# EAGLE schematic ARM_board (EAGLE 6.1)
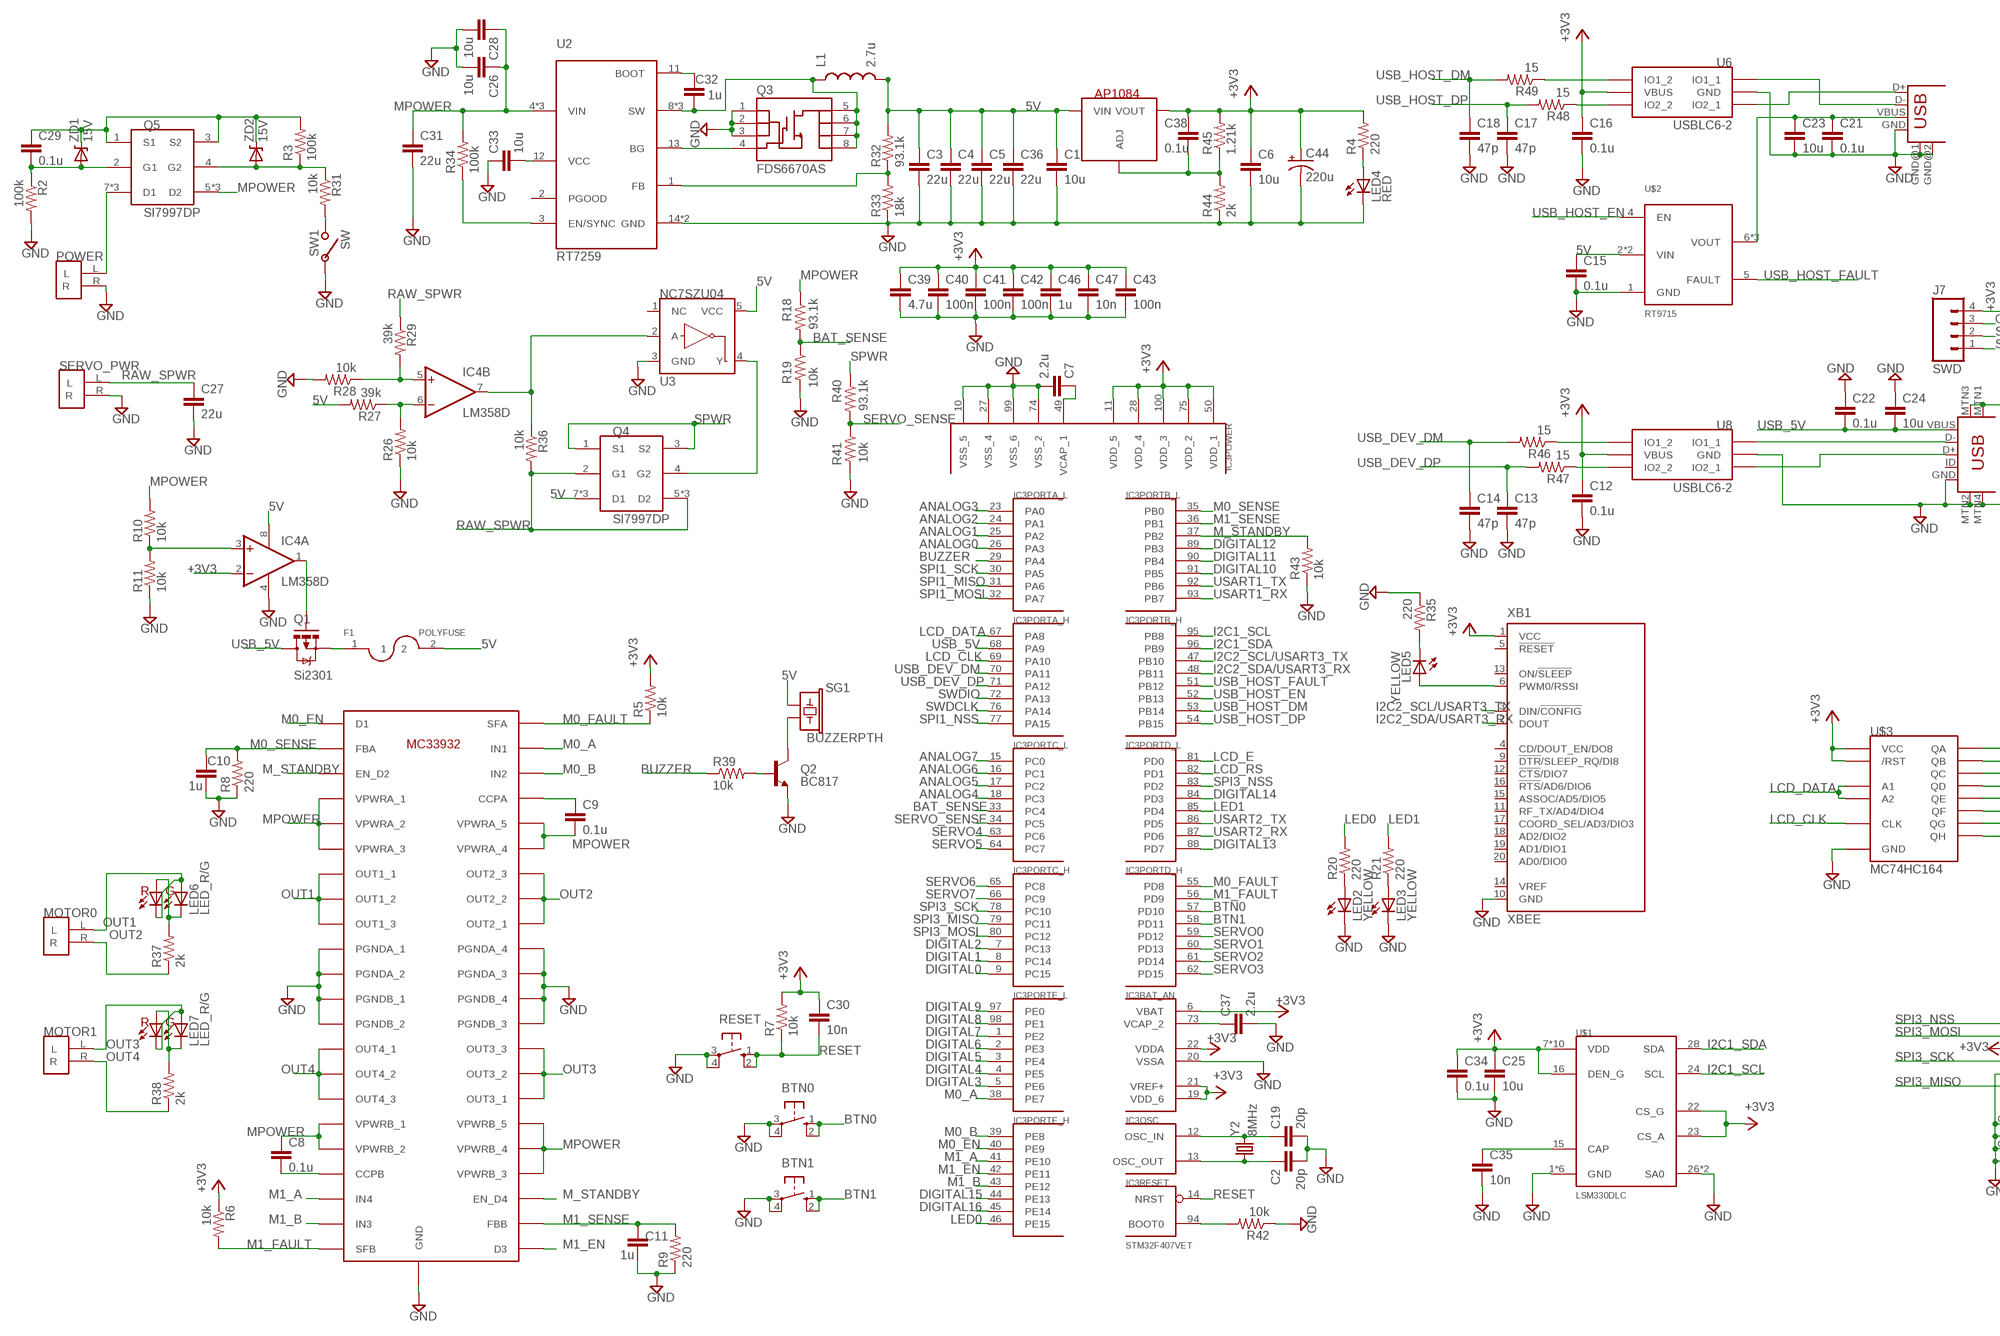
[diagram p0: schematic, sheet 1, part 1 of 2]
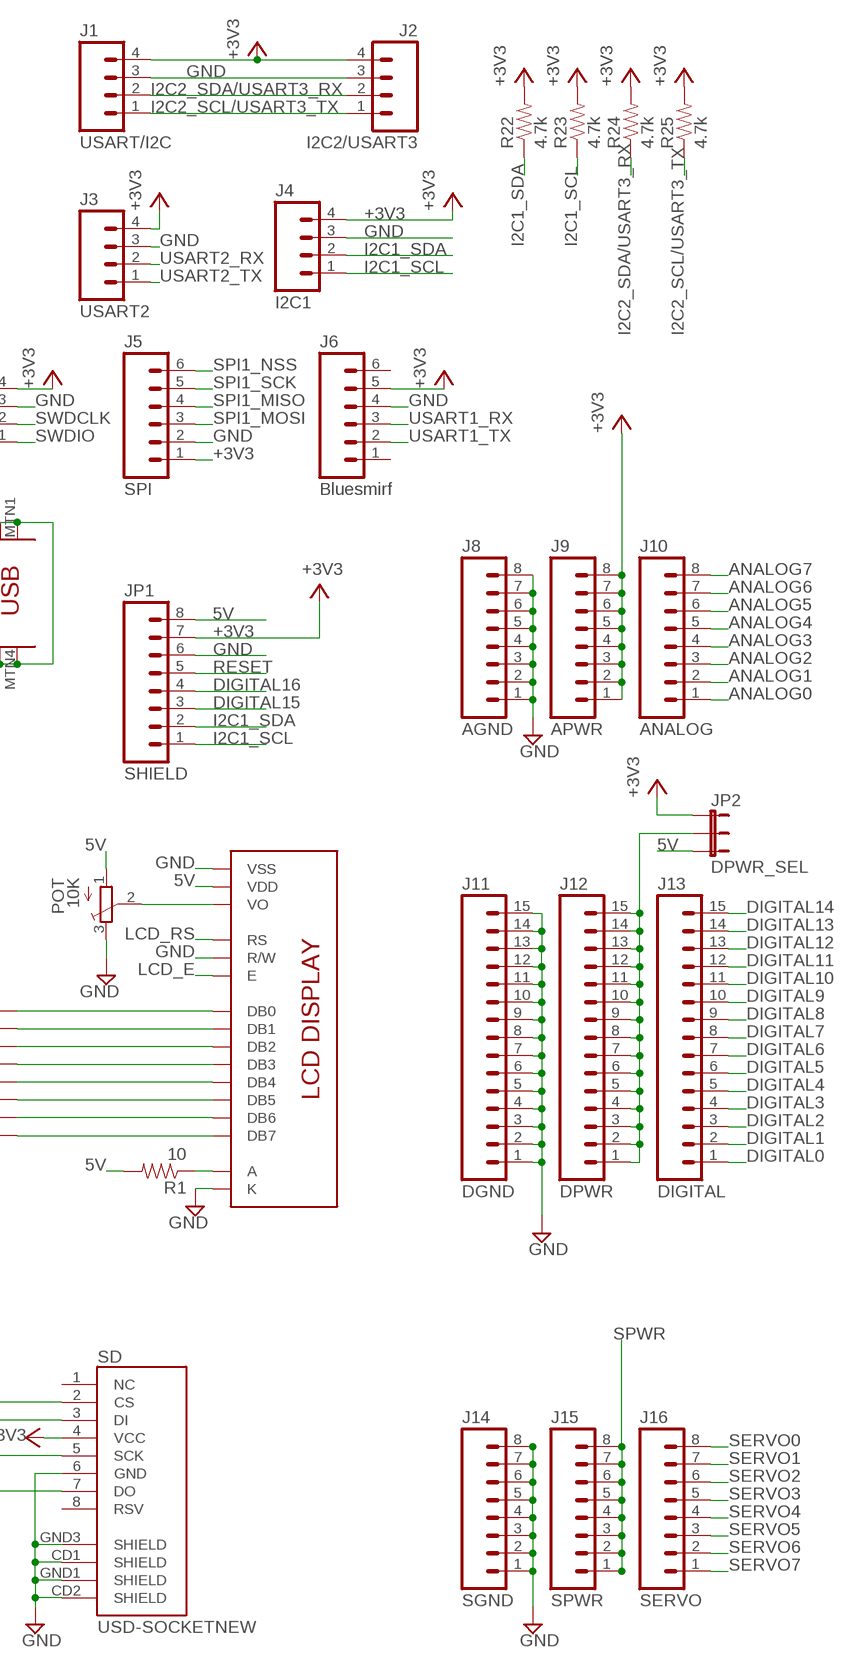
[diagram p1: schematic, sheet 1, part 2 of 2]

## Parts
AP1084  AP1084  [DPAK]
BTN0  10-XX  [B3F-10XX]
BTN1  10-XX  [B3F-10XX]
C1  10u  CAP0805  [0805]
C2  20p  CAP0603-CAP  [0603-CAP]
C3  22u  CAP0805  [0805]
C4  22u  CAP0805  [0805]
C5  22u  CAP0805  [0805]
C6  10u  CAP0805  [0805]
C7  2.2u  CAP0603-CAP  [0603-CAP]
C8  0.1u  CAP0603-CAP  [0603-CAP]
C9  0.1u  CAP0603-CAP  [0603-CAP]
C10  1u  CAP0603-CAP  [0603-CAP]
C11  1u  CAP0603-CAP  [0603-CAP]
C12  0.1u  CAP0603-CAP  [0603-CAP]
C13  47p  CAP0603-CAP  [0603-CAP]
C14  47p  CAP0603-CAP  [0603-CAP]
C15  0.1u  CAP0603-CAP  [0603-CAP]
C16  0.1u  CAP0603-CAP  [0603-CAP]
C17  47p  CAP0603-CAP  [0603-CAP]
C18  47p  CAP0603-CAP  [0603-CAP]
C19  20p  CAP0603-CAP  [0603-CAP]
C21  0.1u  CAP0603-CAP  [0603-CAP]
C22  0.1u  CAP0603-CAP  [0603-CAP]
C23  10u  CAP0805  [0805]
C24  10u  CAP0805  [0805]
C25  10u  CAP0603-CAP  [0603-CAP]
C26  10u  CAP1206  [1206]
C27  22u  CAP1206  [1206]
C28  10u  CAP1206  [1206]
C29  0.1u  CAP0603-CAP  [0603-CAP]
C30  10n  CAP0603-CAP  [0603-CAP]
C31  22u  CAP1206  [1206]
C32  1u  CAP0603-CAP  [0603-CAP]
C33  10u  CAP0805  [0805]
C34  0.1u  CAP0603-CAP  [0603-CAP]
C35  10n  CAP0603-CAP  [0603-CAP]
C36  22u  CAP0805  [0805]
C37  2.2u  CAP0603-CAP  [0603-CAP]
C38  0.1u  CAP0603-CAP  [0603-CAP]
C39  4.7u  CAP0603-CAP  [0603-CAP]
C40  100n  CAP0603-CAP  [0603-CAP]
C41  100n  CAP0603-CAP  [0603-CAP]
C42  100n  CAP0603-CAP  [0603-CAP]
C43  100n  CAP0603-CAP  [0603-CAP]
C44  220u  CAP_POLD  [PANASONIC_D]
C46  1u  CAP0603-CAP  [0603-CAP]
C47  10n  CAP0603-CAP  [0603-CAP]
F1  POLYFUSE  [1206]
IC3  STM32F407VET  [TQFP100]
IC4  LM358D  [SO08]
J1  USART/I2C  M04PTH  [1X04]
J2  I2C2/USART3  M04PTH  [1X04]
J3  USART2  M04PTH  [1X04]
J4  I2C1  M04PTH  [1X04]
J5  SPI  M06SIP  [1X06]
J6  Bluesmirf  M06SIP  [1X06]
J7  SWD  M04PTH  [1X04]
J8  AGND  M081X08  [1X08]
J9  APWR  M081X08  [1X08]
J10  ANALOG  M081X08  [1X08]
J11  DGND  M15  [1X15]
J12  DPWR  M15  [1X15]
J13  DIGITAL  M15  [1X15]
J14  SGND  M081X08  [1X08]
J15  SPWR  M081X08  [1X08]
J16  SERVO  M081X08  [1X08]
JP1  SHIELD  M081X08  [1X08]
JP2  DPWR_SEL  JUMPER-3PTH  [1X03]
L1  2.7u  INDUCTOR  [INDUCTOR]
LCD  LCD_DISPLAY  [LCD]
LED2  YELLOW  LEDCHIP-LED0603  [CHIP-LED0603]
LED3  YELLOW  LEDCHIP-LED0603  [CHIP-LED0603]
LED4  RED  LEDCHIP-LED0603  [CHIP-LED0603]
LED5  YELLOW  LEDCHIP-LED0603  [CHIP-LED0603]
LED6  LED_R/G  LED_BICOLOR  [LED-0606]
LED7  LED_R/G  LED_BICOLOR  [LED-0606]
MOTOR0  2POS_TERMINAL  [2POS_TERMINAL]
MOTOR1  2POS_TERMINAL  [2POS_TERMINAL]
POT  10K  POT  [POT]
POWER  2POS_TERMINAL  [2POS_TERMINAL]
Q1  Si2301  MOSFET-PCHANNELSMD  [SOT23-3]
Q2  BC817  TRANSISTOR_NPNSOT23-3  [SOT23-3]
Q3  FDS6670AS  MOSFET-NCHANNEL-SOIC8  [SO08]
Q4  SI7997DP  [POWERPAK]
Q5  SI7997DP  [POWERPAK]
R1  10  RESISTOR0603-RES  [0603-RES]
R2  100k  RESISTOR0603-RES  [0603-RES]
R3  100k  RESISTOR0603-RES  [0603-RES]
R4  220  RESISTOR0603-RES  [0603-RES]
R5  10k  RESISTOR0603-RES  [0603-RES]
R6  10k  RESISTOR0603-RES  [0603-RES]
R7  10k  RESISTOR0603-RES  [0603-RES]
R8  220  RESISTOR0603-RES  [0603-RES]
R9  220  RESISTOR0603-RES  [0603-RES]
R10  10k  RESISTOR0603-RES  [0603-RES]
R11  10k  RESISTOR0603-RES  [0603-RES]
R18  93.1k  RESISTOR0603-RES  [0603-RES]
R19  10k  RESISTOR0603-RES  [0603-RES]
R20  220  RESISTOR0603-RES  [0603-RES]
R21  220  RESISTOR0603-RES  [0603-RES]
R22  4.7k  RESISTOR0603-RES  [0603-RES]
R23  4.7k  RESISTOR0603-RES  [0603-RES]
R24  4.7k  RESISTOR0603-RES  [0603-RES]
R25  4.7k  RESISTOR0603-RES  [0603-RES]
R26  10k  RESISTOR0603-RES  [0603-RES]
R27  39k  RESISTOR0603-RES  [0603-RES]
R28  10k  RESISTOR0603-RES  [0603-RES]
R29  39k  RESISTOR0603-RES  [0603-RES]
R31  10k  RESISTOR0603-RES  [0603-RES]
R32  93.1k  RESISTOR0603-RES  [0603-RES]
R33  18k  RESISTOR0603-RES  [0603-RES]
R34  100k  RESISTOR0603-RES  [0603-RES]
R35  220  RESISTOR0603-RES  [0603-RES]
R36  10k  RESISTOR0603-RES  [0603-RES]
R37  2k  RESISTOR0603-RES  [0603-RES]
R38  2k  RESISTOR0603-RES  [0603-RES]
R39  10k  RESISTOR0603-RES  [0603-RES]
R40  93.1k  RESISTOR0603-RES  [0603-RES]
R41  10k  RESISTOR0603-RES  [0603-RES]
R42  10k  RESISTOR0603-RES  [0603-RES]
R43  10k  RESISTOR0603-RES  [0603-RES]
R44  2k  RESISTOR0603-RES  [0603-RES]
R45  1.21k  RESISTOR0603-RES  [0603-RES]
R46  15  RESISTOR0603-RES  [0603-RES]
R47  15  RESISTOR0603-RES  [0603-RES]
R48  15  RESISTOR0603-RES  [0603-RES]
R49  15  RESISTOR0603-RES  [0603-RES]
RESET  10-XX  [B3F-10XX]
SD  USD-SOCKETNEW  [MICRO-SD-SOCKET-PP]
SERVO_PWR  2POS_TERMINAL  [2POS_TERMINAL]
SG1  BUZZERPTH  [BUZZER-12MM]
SW1  SW  [SW]
U1  MC33932  [HSOP44]
U2  RT7259  SWITCHING_REG  [WDFN-14L]
U3  NC7SZU04  INVERTER""  [SC70]
U6  USBLC6-2  [SOT23-6L]
U8  USBLC6-2  [SOT23-6L]
U$1  LSM330DLC  [LGA-28]
U$2  RT9715  [8-SOIC]
U$3  MC74HC164  [TSSOP-14]
USB1  USB-A-S  [USB-A-S]
USB2  USB-MINIB-5PIN  [USB-MINIB]
XB1  XBEE  [XBEE]
Y2  8MHz  CRYSTALSMD  [HC49UP]
ZD1  15V  ZENER  [0603]
ZD2  15V  ZENER  [0603]

## Nets
5V: AP1084.3(VIN) C1.1 C3.1 C4.1 C5.1 C15.1 C36.1 F1.2 IC4.8(P:V+) JP1.8 JP2.3 L1.P$2 LCD.VDD POT.1(A) Q4.7(D1) Q4.8(D1) Q4.9(D1) R1.2 R27.2 R32.2 SG1.+ U3.5(VCC) U$2.2(VIN) U$2.3(VIN)
+3V3: AP1084.TAB(VOUT) C6.1 C12.1 C16.1 C25.1 C30.1 C34.1 C38.1 C39.1 C40.1 C41.1 C42.1 C43.1 C44.+ C46.1 C47.1 IC3.6(BAT_AN:VBAT) IC3.11(POWER:VDD_5) IC3.19(BAT_AN:VDD_6) IC3.21(BAT_AN:VREF+) IC3.22(BAT_AN:VDDA) IC3.28(POWER:VDD_4) IC3.50(POWER:VDD_1) IC3.75(POWER:VDD_2) IC3.100(POWER:VDD_3) IC4.2(A:-IN) J1.4 J2.4 J3.4 J4.4 J5.1 J6.5 J7.4 J9.1 J9.2 J9.3 J9.4 J9.5 J9.6 J9.7 J9.8 JP1.7 JP2.1 R4.2 R5.2 R6.1 R7.2 R22.2 R23.2 R24.2 R25.2 R45.2 SD.4(VCC) U6.P$5(VBUS) U8.P$5(VBUS) U$1.7(VDD) U$1.8(VDD) U$1.9(VDD) U$1.10(VDD) U$1.11(VDD) U$1.12(VDD) U$1.13(VDD) U$1.14(VDD) U$1.16(DEN_G) U$1.21(VDD) U$1.22(CS_G) U$1.23(CS_A) U$1.25(VDD) U$3.9(/RST) U$3.14(VCC) XB1.1(VCC)
ANALOG0: IC3.26(PORTA_L:PA3) J10.1
ANALOG1: IC3.25(PORTA_L:PA2) J10.2
ANALOG2: IC3.24(PORTA_L:PA1) J10.3
ANALOG3: IC3.23(PORTA_L:PA0) J10.4
ANALOG4: IC3.18(PORTC_L:PC3) J10.5
ANALOG5: IC3.17(PORTC_L:PC2) J10.6
ANALOG6: IC3.16(PORTC_L:PC1) J10.7
ANALOG7: IC3.15(PORTC_L:PC0) J10.8
BAT_SENSE: IC3.33(PORTC_L:PC4) R18.2 R19.1
BTN0: BTN0.1(S) BTN0.2(S1) IC3.57(PORTD_H:PD10)
BTN1: BTN1.1(S) BTN1.2(S1) IC3.58(PORTD_H:PD11)
BUZZER: IC3.29(PORTA_L:PA4) R39.1
DIGITAL0: IC3.9(PORTC_H:PC15) J13.1
DIGITAL1: IC3.8(PORTC_H:PC14) J13.2
DIGITAL2: IC3.7(PORTC_H:PC13) J13.3
DIGITAL3: IC3.5(PORTE_L:PE6) J13.4
DIGITAL4: IC3.4(PORTE_L:PE5) J13.5
DIGITAL5: IC3.3(PORTE_L:PE4) J13.6
DIGITAL6: IC3.2(PORTE_L:PE3) J13.7
DIGITAL7: IC3.1(PORTE_L:PE2) J13.8
DIGITAL8: IC3.98(PORTE_L:PE1) J13.9
DIGITAL9: IC3.97(PORTE_L:PE0) J13.10
DIGITAL10: IC3.91(PORTB_L:PB5) J13.11
DIGITAL11: IC3.90(PORTB_L:PB4) J13.12
DIGITAL12: IC3.89(PORTB_L:PB3) J13.13
DIGITAL13: IC3.88(PORTD_L:PD7) J13.14
DIGITAL14: IC3.84(PORTD_L:PD3) J13.15
DIGITAL15: IC3.44(PORTE_H:PE13) JP1.3
DIGITAL16: IC3.45(PORTE_H:PE14) JP1.4
GND: BTN0.3(P) BTN0.4(P1) BTN1.3(P) BTN1.4(P1) C1.2 C2.2 C3.2 C4.2 C5.2 C6.2 C7.2 C10.2 C11.2 C12.2 C13.2 C14.2 C15.2 C16.2 C17.2 C18.2 C19.2 C21.2 C22.1 C23.2 C24.1 C25.2 C26.2 C27.2 C28.2 C31.2 C33.1 C34.2 C35.2 C36.2 C37.2 C39.2 C40.2 C41.2 C42.2 C43.2 C44.- C46.2 C47.2 IC3.10(POWER:VSS_5) IC3.20(BAT_AN:VSSA) IC3.27(POWER:VSS_4) IC3.74(POWER:VSS_2) IC3.99(POWER:VSS_6) IC4.4(P:V-) J1.3 J2.3 J3.3 J4.3 J5.2 J6.4 J7.3 J8.1 J8.2 J8.3 J8.4 J8.5 J8.6 J8.7 J8.8 J11.1 J11.2 J11.3 J11.4 J11.5 J11.6 J11.7 J11.8 J11.9 J11.10 J11.11 J11.12 J11.13 J11.14 J11.15 J14.1 J14.2 J14.3 J14.4 J14.5 J14.6 J14.7 J14.8 JP1.6 LCD.K LCD.R/W LCD.VSS LED2.C LED3.C LED4.C POT.3(E) POWER.R Q2.2(E) Q3.1(S) Q3.2(S) Q3.3(S) R2.2 R8.1 R9.1 R11.1 R19.2 R26.1 R28.2 R33.1 R35.1 R41.2 R42.1 R43.1 R44.1 RESET.3(P) RESET.4(P1) SD.6(GND) SD.CD1(SHIELD) SD.CD2(SHIELD) SD.GND1(SHIELD) SD.GND3(SHIELD) SERVO_PWR.R SW1.P$2 U1.P$10(PGNDA_1) U1.P$11(PGNDA_2) U1.P$12(PGNDB_1) U1.P$13(PGNDB_2) U1.P$32(PGNDB_3) U1.P$33(PGNDB_4) U1.P$34(PGNDA_3) U1.P$35(PGNDA_4) U1.P$45(GND) U1.P$46(GND) U1.P$47(GND) U2.14(GND) U2.P$1(GND) U3.3(GND) U6.P$2(GND) U8.P$2(GND) U$1.1(GND) U$1.2(GND) U$1.3(GND) U$1.4(GND) U$1.5(GND) U$1.6(GND) U$1.26(SA0) U$1.27(SA0) U$2.1(GND) U$3.7(GND) USB1.GND USB1.GND@1(GND) USB1.GND@2(GND) USB2.GND USB2.MTN1(MTN2) USB2.MTN2(MTN3) USB2.MTN3(MTN1) USB2.MTN4 XB1.10(GND)
I2C1_SCL: IC3.95(PORTB_H:PB8) J4.1 JP1.1 R23.1 U$1.24(SCL)
I2C1_SDA: IC3.96(PORTB_H:PB9) J4.2 JP1.2 R22.1 U$1.28(SDA)
I2C2_SCL/USART3_TX: IC3.47(PORTB_H:PB10) J1.1 J2.1 R25.1 XB1.3(DIN/!CONFIG)
I2C2_SDA/USART3_RX: IC3.48(PORTB_H:PB11) J1.2 J2.2 R24.1 XB1.2(DOUT)
LCD_CLK: IC3.69(PORTA_H:PA10) U$3.8(CLK)
LCD_DATA: IC3.67(PORTA_H:PA8) U$3.1(A1) U$3.2(A2)
LCD_E: IC3.81(PORTD_L:PD0) LCD.E
LCD_RS: IC3.82(PORTD_L:PD1) LCD.RS
LED0: IC3.46(PORTE_H:PE15) R20.2
LED1: IC3.85(PORTD_L:PD4) R21.2
M0_A: IC3.38(PORTE_L:PE7) U1.P$43(IN1)
M0_B: IC3.39(PORTE_H:PE8) U1.P$42(IN2)
M0_EN: IC3.40(PORTE_H:PE9) U1.P$1(D1)
M0_FAULT: IC3.55(PORTD_H:PD8) R5.1 U1.P$44(SFA)
M0_SENSE: C10.1 IC3.35(PORTB_L:PB0) R8.2 U1.P$2(FBA)
M1_A: IC3.41(PORTE_H:PE10) U1.P$20(IN4)
M1_B: IC3.43(PORTE_H:PE12) U1.P$21(IN3)
M1_EN: IC3.42(PORTE_H:PE11) U1.P$23(D3)
M1_FAULT: IC3.56(PORTD_H:PD9) R6.2 U1.P$22(SFB)
M1_SENSE: C11.1 IC3.36(PORTB_L:PB1) R9.2 U1.P$24(FBB)
M_STANDBY: IC3.37(PORTB_L:PB2) R43.2 U1.P$3(EN_D2) U1.P$25(EN_D4)
MPOWER: C8.1 C9.2 C26.1 C28.1 C31.1 Q5.5(D2) Q5.6(D2) Q5.10(D2) R10.2 R18.1 R34.2 U1.P$4(VPWRA_1) U1.P$5(VPWRA_2) U1.P$6(VPWRA_3) U1.P$17(VPWRB_1) U1.P$18(VPWRB_2) U1.P$26(VPWRB_3) U1.P$27(VPWRB_4) U1.P$28(VPWRB_5) U1.P$39(VPWRA_4) U1.P$40(VPWRA_5) U2.4(VIN) U2.5(VIN) U2.6(VIN)
N$1: POWER.L Q5.7(D1) Q5.8(D1) Q5.9(D1)
N$2: C29.2 Q5.2(G1) R2.1 ZD1.P$1(A)
N$3: IC3.94(RESET:BOOT0) R42.2
N$4: C37.1 IC3.73(BAT_AN:VCAP_2)
N$5: IC4.3(A:+IN) R10.1 R11.2
N$6: R46.1 U8.P$6(IO1_2)
N$7: U8.P$1(IO1_1) USB2.D-
N$8: U8.P$3(IO2_1) USB2.D+
N$9: LED4.A R4.1
N$10: C32.2 L1.P$1 Q3.5(D) Q3.6(D) Q3.7(D) Q3.8(D) U2.8(SW) U2.9(SW) U2.10(SW)
N$11: C35.1 U$1.15(CAP)
N$12: IC4.5(B:+IN) R28.1 R29.2
N$13: U6.P$3(IO2_1) USB1.D+
N$14: IC4.1(A:OUT) Q1.1(G)
N$15: F1.1 Q1.2(S)
N$16: U6.P$1(IO1_1) USB1.D-
N$17: R32.1 R33.2 U2.1(FB)
N$18: LED5.C R35.2
N$19: J12.1 J12.2 J12.3 J12.4 J12.5 J12.6 J12.7 J12.8 J12.9 J12.10 J12.11 J12.12 J12.13 J12.14 J12.15 JP2.2
N$20: C33.2 U2.12(VCC)
N$21: C21.1 C23.1 U$2.6(VOUT) U$2.7(VOUT) U$2.8(VOUT) USB1.VBUS
N$22: R31.2 SW1.P$1
N$23: C29.1 Q5.1(S1) Q5.3(S2) R3.2 ZD1.P$2(C) ZD2.P$2(C)
N$24: C7.1 IC3.49(POWER:VCAP_1)
N$25: C32.1 U2.11(BOOT)
N$26: IC4.6(B:-IN) R26.2 R27.1
N$27: IC4.7(B:OUT) R36.1 U3.2(A)
N$28: Q2.3(C) SG1.-
N$29: LED5.A XB1.6(PWM0/RSSI)
N$30: Q4.4(G2) U3.4(Y)
N$31: LCD.VO POT.2(S)
N$32: AP1084.1(ADJ) C38.2 R44.2 R45.1
N$33: R47.1 U8.P$4(IO2_2)
N$34: R48.1 U6.P$4(IO2_2)
N$35: Q3.4(G) U2.13(BG)
N$36: R49.1 U6.P$6(IO1_2)
N$42: LED2.A R20.1
N$43: LED3.A R21.1
N$44: R34.1 U2.3(EN/SYNC)
N$46: C19.1 IC3.12(OSC:OSC_IN) Y2.2
N$47: C2.1 IC3.13(OSC:OSC_OUT) Y2.1
N$49: C9.1 U1.P$41(CCPA)
N$50: C8.2 U1.P$19(CCPB)
N$51: LED6.1 LED6.4 R37.2
N$52: LED7.1 LED7.4 R38.2
N$54: LCD.A R1.1
N$58: LCD.DB0 U$3.3(QA)
N$60: LCD.DB1 U$3.4(QB)
N$61: LCD.DB2 U$3.5(QC)
N$62: LCD.DB3 U$3.6(QD)
N$63: LCD.DB4 U$3.10(QE)
N$64: LCD.DB5 U$3.11(QF)
N$65: Q2.1(B) R39.2
N$68: Q5.4(G2) R3.1 R31.1 ZD2.P$1(A)
N$70: LCD.DB6 U$3.12(QG)
N$71: LCD.DB7 U$3.13(QH)
OUT1: LED6.2 LED6.3 MOTOR0.L U1.P$7(OUT1_1) U1.P$8(OUT1_2) U1.P$9(OUT1_3)
OUT2: MOTOR0.R R37.1 U1.P$36(OUT2_1) U1.P$37(OUT2_2) U1.P$38(OUT2_3)
OUT3: LED7.2 LED7.3 MOTOR1.L U1.P$29(OUT3_1) U1.P$30(OUT3_2) U1.P$31(OUT3_3)
OUT4: MOTOR1.R R38.1 U1.P$14(OUT4_1) U1.P$15(OUT4_2) U1.P$16(OUT4_3)
RAW_SPWR: C27.1 Q4.2(G1) Q4.5(D2) Q4.6(D2) Q4.10(D2) R29.1 R36.2 SERVO_PWR.L
RESET: C30.2 IC3.14(RESET:NRST) JP1.5 R7.1 RESET.1(S) RESET.2(S1)
SERVO0: IC3.59(PORTD_H:PD12) J16.8
SERVO1: IC3.60(PORTD_H:PD13) J16.7
SERVO2: IC3.61(PORTD_H:PD14) J16.6
SERVO3: IC3.62(PORTD_H:PD15) J16.5
SERVO4: IC3.63(PORTC_L:PC6) J16.4
SERVO5: IC3.64(PORTC_L:PC7) J16.3
SERVO6: IC3.65(PORTC_H:PC8) J16.2
SERVO7: IC3.66(PORTC_H:PC9) J16.1
SERVO_SENSE: IC3.34(PORTC_L:PC5) R40.2 R41.1
SPI1_MISO: IC3.31(PORTA_L:PA6) J5.4
SPI1_MOSI: IC3.32(PORTA_L:PA7) J5.3
SPI1_NSS: IC3.77(PORTA_H:PA15) J5.6
SPI1_SCK: IC3.30(PORTA_L:PA5) J5.5
SPI3_MISO: IC3.79(PORTC_H:PC11) SD.7(DO)
SPI3_MOSI: IC3.80(PORTC_H:PC12) SD.3(DI)
SPI3_NSS: IC3.83(PORTD_L:PD2) SD.2(CS)
SPI3_SCK: IC3.78(PORTC_H:PC10) SD.5(SCK)
SPWR: J15.1 J15.2 J15.3 J15.4 J15.5 J15.6 J15.7 J15.8 Q4.1(S1) Q4.3(S2) R40.1
SWDCLK: IC3.76(PORTA_H:PA14) J7.2
SWDIO: IC3.72(PORTA_H:PA13) J7.1
USART1_RX: IC3.93(PORTB_L:PB7) J6.3
USART1_TX: IC3.92(PORTB_L:PB6) J6.2
USART2_RX: IC3.87(PORTD_L:PD6) J3.2
USART2_TX: IC3.86(PORTD_L:PD5) J3.1
USB_5V: C22.2 C24.2 IC3.68(PORTA_H:PA9) Q1.3(D) USB2.VBUS
USB_DEV_DM: C14.1 IC3.70(PORTA_H:PA11) R46.2
USB_DEV_DP: C13.1 IC3.71(PORTA_H:PA12) R47.2
USB_HOST_DM: C18.1 IC3.53(PORTB_H:PB14) R49.2
USB_HOST_DP: C17.1 IC3.54(PORTB_H:PB15) R48.2
USB_HOST_EN: IC3.52(PORTB_H:PB13) U$2.4(EN)
USB_HOST_FAULT: IC3.51(PORTB_H:PB12) U$2.5(FAULT)
Unconnected: J6.1 J6.6 SD.1(NC) SD.8(RSV) U2.2(PGOOD) U3.1(NC) USB2.ID XB1.4(CD/DOUT_EN/DO8) XB1.5(!RESET) XB1.9(!DTR!/SLEEP_RQ/DI8) XB1.11(RF_TX/AD4/DIO4) XB1.12(!CTS!/DIO7) XB1.13(ON/!SLEEP) XB1.14(VREF) XB1.15(ASSOC/AD5/DIO5) XB1.16(!RTS!/AD6/DIO6) XB1.17(COORD_SEL/AD3/DIO3) XB1.18(AD2/DIO2) XB1.19(AD1/DIO1) XB1.20(AD0/DIO0)

## Library data of the parts
AP1084 = r_cubed:AP1084
BTN0 BTN1 RESET = switch-omron:10-XX: OMRON SWITCH; MPN: B3F-1000; OC_FARNELL: 176432; OC_NEWARK: 36M3542
C1-C19 C21-C43 C46 C47 = SparkFun:CAP: Capacitor Standard 0603 ceramic capacitor, and 0.1" leaded capacitor.
C44 = SparkFun:CAP_POL: Capacitor Polarized These are standard SMD and PTH capacitors. Normally 10uF, 47uF, and 100uF in electrolytic and tantalum varieties. Always verify the external diameter of the through hole cap, it varies with capacity, voltage, and manufacturer. The EIA devices should be standard.
F1 = r_cubed:POLYFUSE
IC3 = new_parts:STM32F407VET: STM32F405/407 100 pin LQFP
IC4 = linear:LM358: OP AMP also LM158; LM258; LM2904 Source: http://cache.national.com/ds/LM/LM158.pdf
J1-J4 J7 = SparkFun:M04: Header 4 Standard 4-pin 0.1" header. Use with straight break away headers (SKU : PRT-00116), right angle break away headers (PRT-00553), swiss pins (PRT-00743), machine pins (PRT-00117), and female headers (PRT-00115). Molex polarized connector foot print use with SKU : PRT-08231 with associated crimp pins and housings. 1MM SMD Version SKU: PRT-10208
J5 J6 = SparkFun:M06: Header 6 Standard 6-pin 0.1" header. Use with straight break away headers (SKU : PRT-00116), right angle break away headers (PRT-00553), swiss pins (PRT-00743), machine pins (PRT-00117), and female headers (PRT-00115). Molex polarized connector foot print use with SKU : PRT-08094 with associated crimp pins and housings. NOTES ON THE VARIANTS LOCK and LOCK_LONGPADS... This footprint was designed to help hold the alignment of a through-hole component (i.e. 6-pin header) while soldering it into place. You may notice that each hole has been shifted either up or down by 0.005 of an inch from it's more standard position (which is a perfectly straight line). This slight alteration caused the pins (the squares in the middle) to touch the edges of the holes. Because they are alternating, it causes a "brace" to hold the component in place. 0.005 has proven to be the perfect amount of "off-center" position when using our standard breakaway headers. Although looks a little odd when you look at the bare footprint, once you have a header in there, the alteration is very hard to notice. Also, if you push a header all the way into place, it is covered up entirely on the bottom side. This idea of altering the position of holes to aid alignment will be further integrated into the Sparkfun Library for other footprints. It can help hold any component with 3 or more connection pins.
J8-J10 J14-J16 JP1 = SparkFun:M08: Header 8 Standard 8-pin 0.1" header. Use with straight break away headers (SKU : PRT-00116), right angle break away headers (PRT-00553), swiss pins (PRT-00743), machine pins (PRT-00117), and female headers (PRT-00115).
J11-J13 = SparkFun:M15: Header 15 Standard 15-pin 0.1" header. Use with straight break away headers (SKU : PRT-00116), right angle break away headers (PRT-00553), swiss pins (PRT-00743), machine pins (PRT-00117), and female headers (PRT-00115).
JP2 = SparkFun:JUMPER-3
L1 = r_cubed:INDUCTOR
LCD = arduinoShield:LCD_DISPLAY
LED2-LED5 = led:LED: LED OSRAM: - CHIPLED LG R971, LG N971, LY N971, LG Q971, LY Q971, LO R971, LY R971 LH N974, LH R974 LS Q976, LO Q976, LY Q976 LO Q996 - Hyper CHIPLED LW Q18S LB Q993, LB Q99A, LB R99A - SideLED LS A670, LO A670, LY A670, LG A670, LP A670 LB A673, LV A673, LT A673, LW A673 LH A674 LY A675 LS A676, LA A676, LO A676, LY A676, LW A676 LS A679, LY A679, LG A679 - Hyper Micro SIDELED® LS Y876, LA Y876, LO Y876, LY Y876 LT Y87S - SmartLED LW L88C, LW L88S LB L89C, LB L89S, LG L890 LS L89K, LO L89K, LY L89K LS L896, LA L896, LO L896, LY L896 - TOPLED LS T670, LO T670, LY T670, LG T670, LP T670 LSG T670, LSP T670, LSY T670, LOP T670, LYG T670 LG T671, LOG T671, LSG T671 LB T673, LV T673, LT T673, LW T673 LH T674 LS T676, LA T676, LO T676, LY T676, LB T676, LH T676, LSB T676, LW T676 LB T67C, LV T67C, LT T67C, LS T67K, LO T67K, LY T67K, LW E67C LS E67B, LA E67B, LO E67B, LY E67B, LB E67C, LV E67C, LT E67C LW T67C LS T679, LY T679, LG T679 LS T770, LO T770, LY T770, LG T770, LP T770 LB T773, LV T773, LT T773, LW T773 LH T774 LS E675, LA E675, LY E675, LS T675 LS T776, LA T776, LO T776, LY T776, LB T776 LHGB T686 LT T68C, LB T68C - Hyper Mini TOPLED® LB M676 - Mini TOPLED Santana® LG M470 LS M47K, LO M47K, LY M47K Source: http://www.osram.convergy.de LUXEON: - LUMILED® LXK2-PW12-R00, LXK2-PW12-S00, LXK2-PW14-U00, LXK2-PW14-V00 LXK2-PM12-R00, LXK2-PM12-S00, LXK2-PM14-U00 LXK2-PE12-Q00, LXK2-PE12-R00, LXK2-PE12-S00, LXK2-PE14-T00, LXK2-PE14-U00 LXK2-PB12-K00, LXK2-PB12-L00, LXK2-PB12-M00, LXK2-PB14-N00, LXK2-PB14-P00, LXK2-PB14-Q00 LXK2-PR12-L00, LXK2-PR12-M00, LXK2-PR14-Q00, LXK2-PR14-R00 LXK2-PD12-Q00, LXK2-PD12-R00, LXK2-PD12-S00 LXK2-PH12-R00, LXK2-PH12-S00 LXK2-PL12-P00, LXK2-PL12-Q00, LXK2-PL12-R00 Source: www.luxeon.com KINGBRIGHT: KA-3528ASYC Source: www.kingbright.com
LED6 LED7 = r_cubed:LED_BICOLOR
MOTOR0 MOTOR1 POWER SERVO_PWR = r_cubed:2POS_TERMINAL
POT = r_cubed:POT
Q1 = SparkFun:MOSFET-PCHANNEL
Q2 = SparkFun:TRANSISTOR_NPN: Transistor NPN BJT configuration in SOT23 package. MMBT2222 is the common NPN we use. Double check BCE configuration again layout.
Q3 = SparkFun:MOSFET-NCHANNEL-SOIC8: N-Channel MOSFET IRF9410 and NDS8434 are common, SOIC-8 parts.
Q4 Q5 = r_cubed:SI7997DP
R1-R11 R18-R29 R31-R49 = SparkFun:RESISTOR: Resistor Basic schematic elements and footprints for 0603, 1206, and PTH resistors.
SD = SparkFun:USD-SOCKET: microSD Socket Push-push type uSD socket. Schematic element and footprint production proven. Spark Fun Electronics SKU : PRT-00127. tDoc lines correctly indicate media card edge positions when inserting (unlocked, locked, depressed).
SG1 = SparkFun:BUZZER: Buzzer 12mm Spark Fun Electronics SKU : Comp-Buzzer
SW1 = r_cubed:SW
U1 = new_parts:MC33932: Freescale dual H-bridge MC33932
U2 = r_cubed:SWITCHING_REG: RT7259 1028-1199-1-ND
U3 = SparkFun:INVERTER: Single inverter, SOT23-5
U6 U8 = new_parts:USBLC6-2: ST USBLC6-2
U$1 = r_cubed:LSM330DLC
U$2 = r_cubed:RT9715
U$3 = r_cubed:MC74HC164
USB1 = con-usb-2:USB: USB Connectors
USB2 = SparkFun:USB-MINIB: Mini-USB "B" connector with 5th pin broken out. Created new symbol breaking out 5th "ID" pin in mini/micro USB connector spec. See: http://en.wikipedia.org/wiki/Mini_usb#Cables. Uses same footprint as 4-pin symbol. Also added pins to connect to mounting / shield pads if required (probably not generally needed as signals aren't shielded once they leave the connector).
XB1 = maxstream:XBEE: XBee (TM) /XBee-PRO(TM) OEM RF Modules Source: MaxStream, Inc. xbee_productmanual.pdf; MPN: XBP24-Z7UIT-004; OC_FARNELL: 1751799; OC_NEWARK: 34R5507
Y2 = SparkFun:CRYSTAL: Crystals Various standard crystals. Proven footprints. Spark Fun Electronics SKU : COM-00534
ZD1 ZD2 = r_cubed:ZENER: http://www.comchiptech.com/cms/UserFiles/CZRU52C2%20THRU%20CZRU52C39-RevB.pdf